# EAGLE design Placa_painel_Revisao (EAGLE 9.4.2)

## Sheet 1 of 2
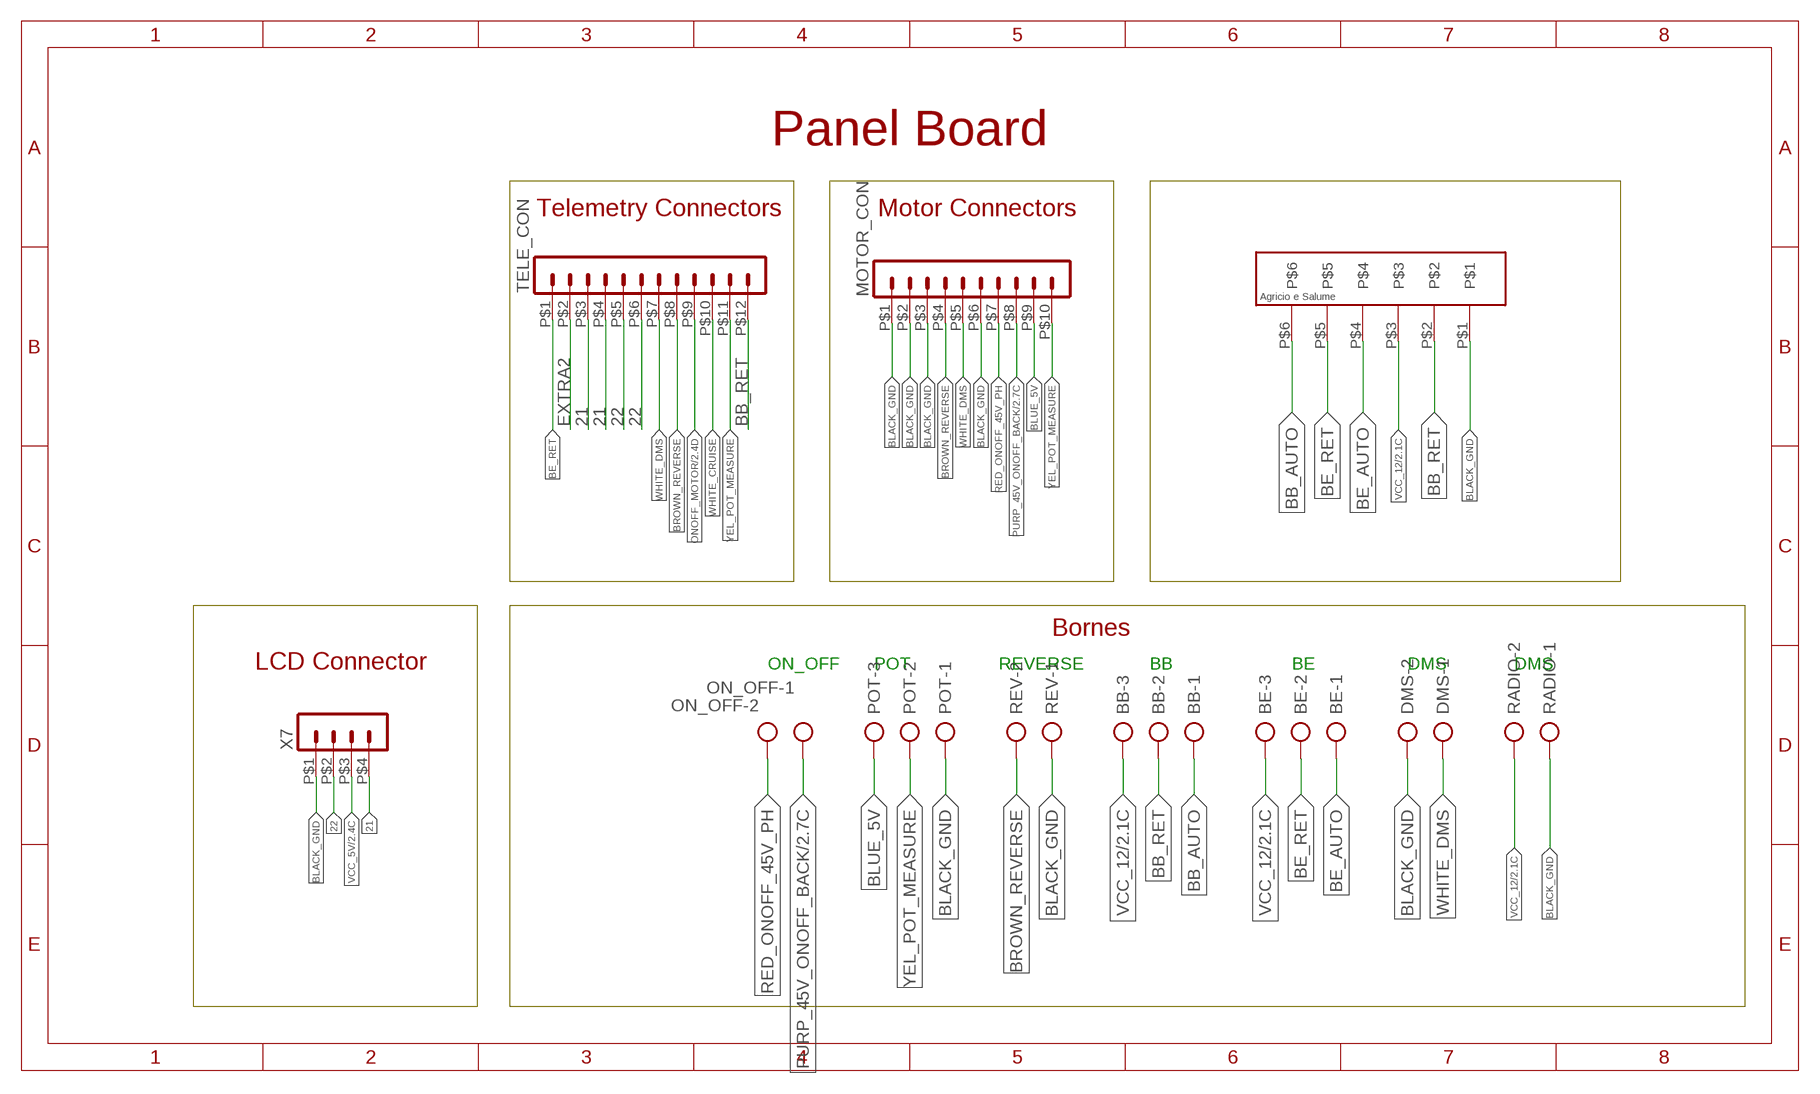
[diagram p0: schematic, sheet 1]

### Parts
BB  AK500/3  [AK500/3]
BE  AK500/3  [AK500/3]
DMS  AK500/2  [AK500/2]
MOTOR_CON  HEADER_POS10_43045-1012  [43045-1012]
ON_OFF  AK500/2  [AK500/2]
POT  AK500/3  [AK500/3]
RADIO  AK500/2  [AK500/2]
REV  AK500/2  [AK500/2]
TELE_CON  HEADER_POS12_43045-1212  [43045-1212]
U$1  CON_HOLE  [CON_HOLE_6]
X7  HEADER_POS4_43045-0412  [43045-0412]

### Nets
21: TELE_CON.P$3 TELE_CON.P$4 X7.P$4
22: TELE_CON.P$5 TELE_CON.P$6 X7.P$2
BB_AUTO: BB.1 U$1.P$6
BB_RET: BB.2 TELE_CON.P$12 U$1.P$2
BE_AUTO: BE.1 U$1.P$4
BE_RET: BE.2 TELE_CON.P$1 U$1.P$5
BLACK_GND: DMS.2 MOTOR_CON.P$1 MOTOR_CON.P$2 MOTOR_CON.P$3 MOTOR_CON.P$6 POT.1 RADIO.1 REV.1 U$1.P$1 X7.P$1 ; also sheet 2
BLUE_5V: MOTOR_CON.P$9 POT.3
BROWN_REVERSE: MOTOR_CON.P$4 REV.2 TELE_CON.P$8
EXTRA2: TELE_CON.P$2
ONOFF_MOTOR: TELE_CON.P$9 ; also sheet 2
PURP_45V_ONOFF_BACK: MOTOR_CON.P$8 ON_OFF.1 ; also sheet 2
RED_ONOFF_45V_PH: MOTOR_CON.P$7 ON_OFF.2
VCC_5V: X7.P$3 ; also sheet 2
VCC_12: BB.3 BE.3 RADIO.2 U$1.P$3 ; also sheet 2
WHITE_CRUISE: TELE_CON.P$10
WHITE_DMS: DMS.1 MOTOR_CON.P$5 TELE_CON.P$7
YEL_POT_MEASURE: MOTOR_CON.P$10 POT.2 TELE_CON.P$11

### Notes on the sheet
- Panel Board
- Telemetry Connectors | Motor Connectors
- Bornes
- LCD Connector
- ON_OFF | POT | REVERSE | BB | BE | DMS | DMS

## Sheet 2 of 2
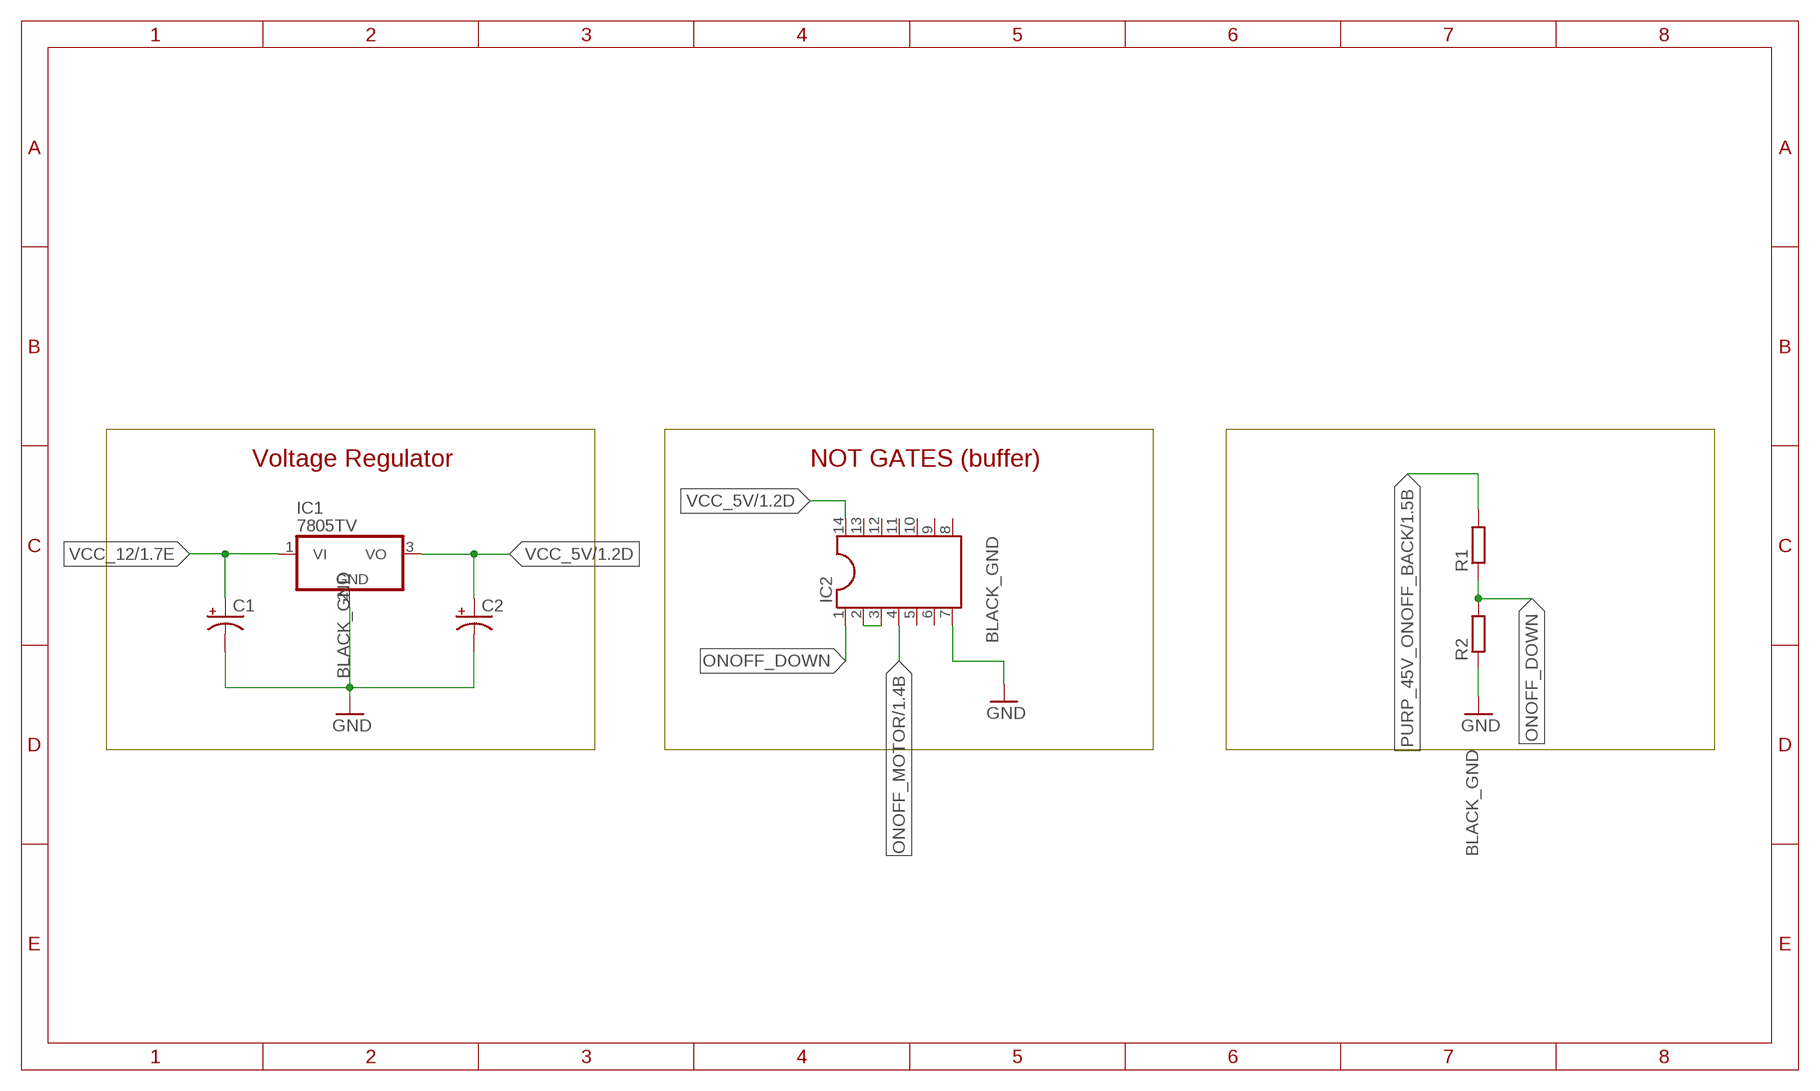
[diagram p1: schematic, sheet 2]

### Parts
C1  CPOL-USE5-5  [E5-5]
C2  CPOL-USE5-5  [E5-5]
IC1  7805TV  [TO220V]
IC2  DIL14  [DIL14]
R1  R-EU_0204/7  [0204/7]
R2  R-EU_0204/7  [0204/7]

### Nets
BLACK_GND: C1.- C2.- IC1.2(GND) IC2.7 R2.1 ; supply symbol labelled GND ; also sheet 1
N$4: IC2.2 IC2.3
ONOFF_DOWN: IC2.1 R1.1 R2.2
ONOFF_MOTOR: IC2.4 ; also sheet 1
PURP_45V_ONOFF_BACK: R1.2 ; also sheet 1
VCC_5V: C2.+ IC1.3(VO) IC2.14 ; also sheet 1
VCC_12: C1.+ IC1.1(VI) ; also sheet 1
Unconnected: IC2.5 IC2.6 IC2.8 IC2.9 IC2.10 IC2.11 IC2.12 IC2.13

### Notes on the sheet
- Voltage Regulator | NOT GATES (buffer)

## Library data of the parts
BB BE POT = con-ptr500:AK500/3: CONNECTOR; OC_FARNELL: unknown; OC_NEWARK: unknown
C1 C2 = rcl:CPOL-US: POLARIZED CAPACITOR, American symbol; SPICEPREFIX: C
DMS ON_OFF RADIO REV = con-ptr500:AK500/2: CONNECTOR; OC_FARNELL: unknown; OC_NEWARK: unknown
IC1 = linear:78*: Positive VOLTAGE REGULATOR Source: http://cache.national.com/ds/LM/LM78L05.pdf http://www.fairchildsemi.com/ds/LM/LM7805.pdf
IC2 = ic-package:DIL14: Dual In Line / Socket
MOTOR_CON = con-molex-micro-fit-3_0:HEADER_POS10_?: Molex - Micro-Fit 3.0 Series connector, 3.00mm (0.118") pitch header, 10 positions.
R1 R2 = rcl:R-EU_: RESISTOR, European symbol; SPICEPREFIX: R
TELE_CON = con-molex-micro-fit-3_0:HEADER_POS12_?: Molex - Micro-Fit 3.0 Series connector, 3.00mm (0.118") pitch header, 12 positions.
U$1 = bibliotecattgo:CON_HOLE
X7 = con-molex-micro-fit-3_0:HEADER_POS4_?: Molex - Micro-Fit 3.0 Series connector, 3.00mm (0.118") pitch header, 4 positions.

## Board
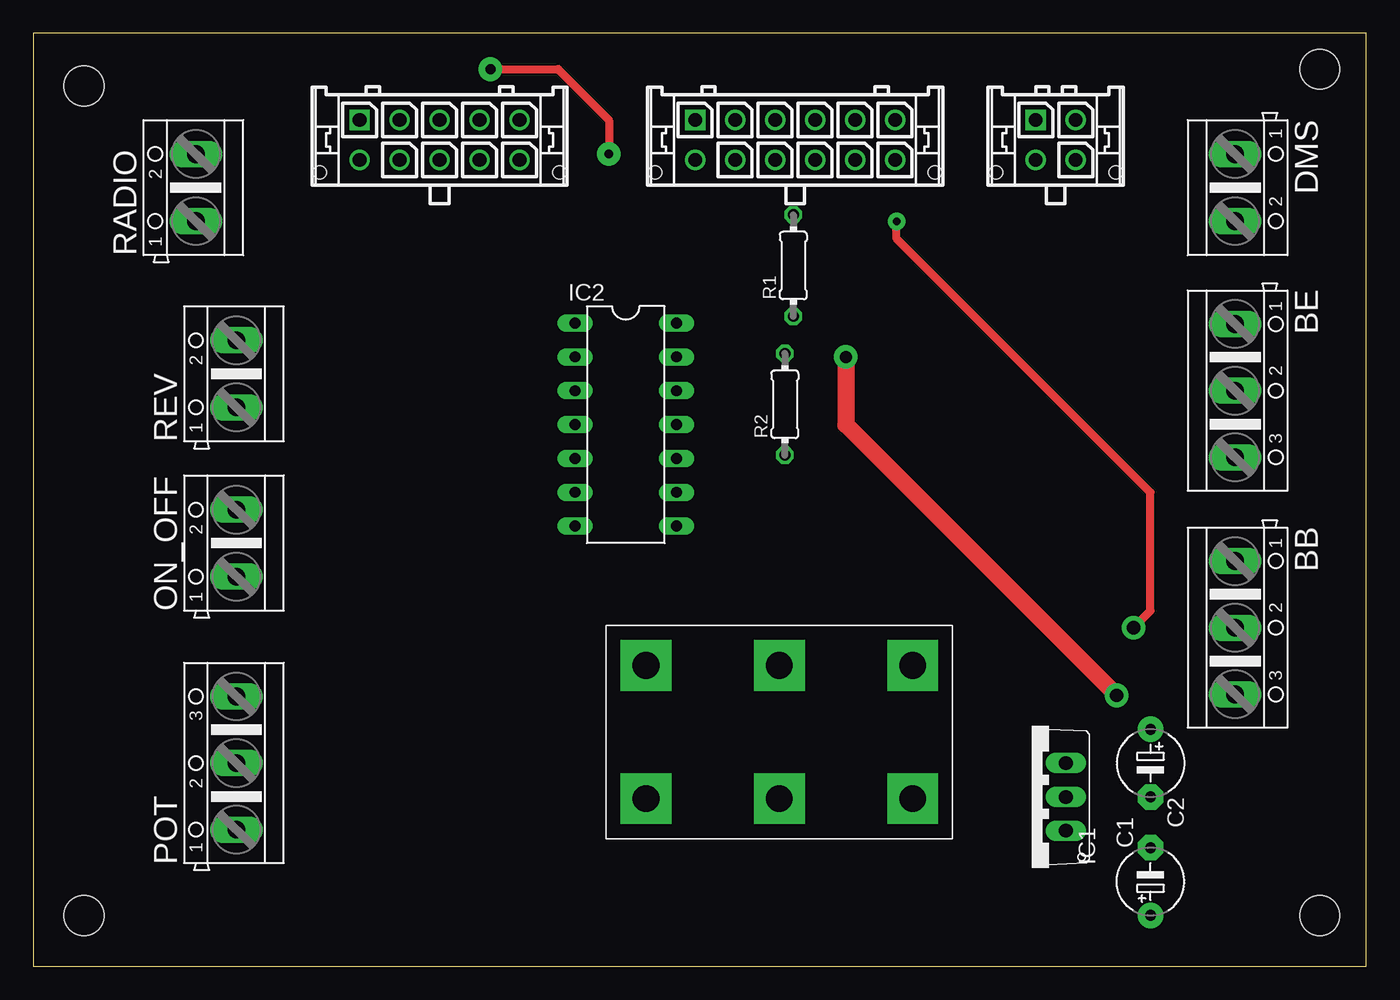
[diagram p2: board, top side]
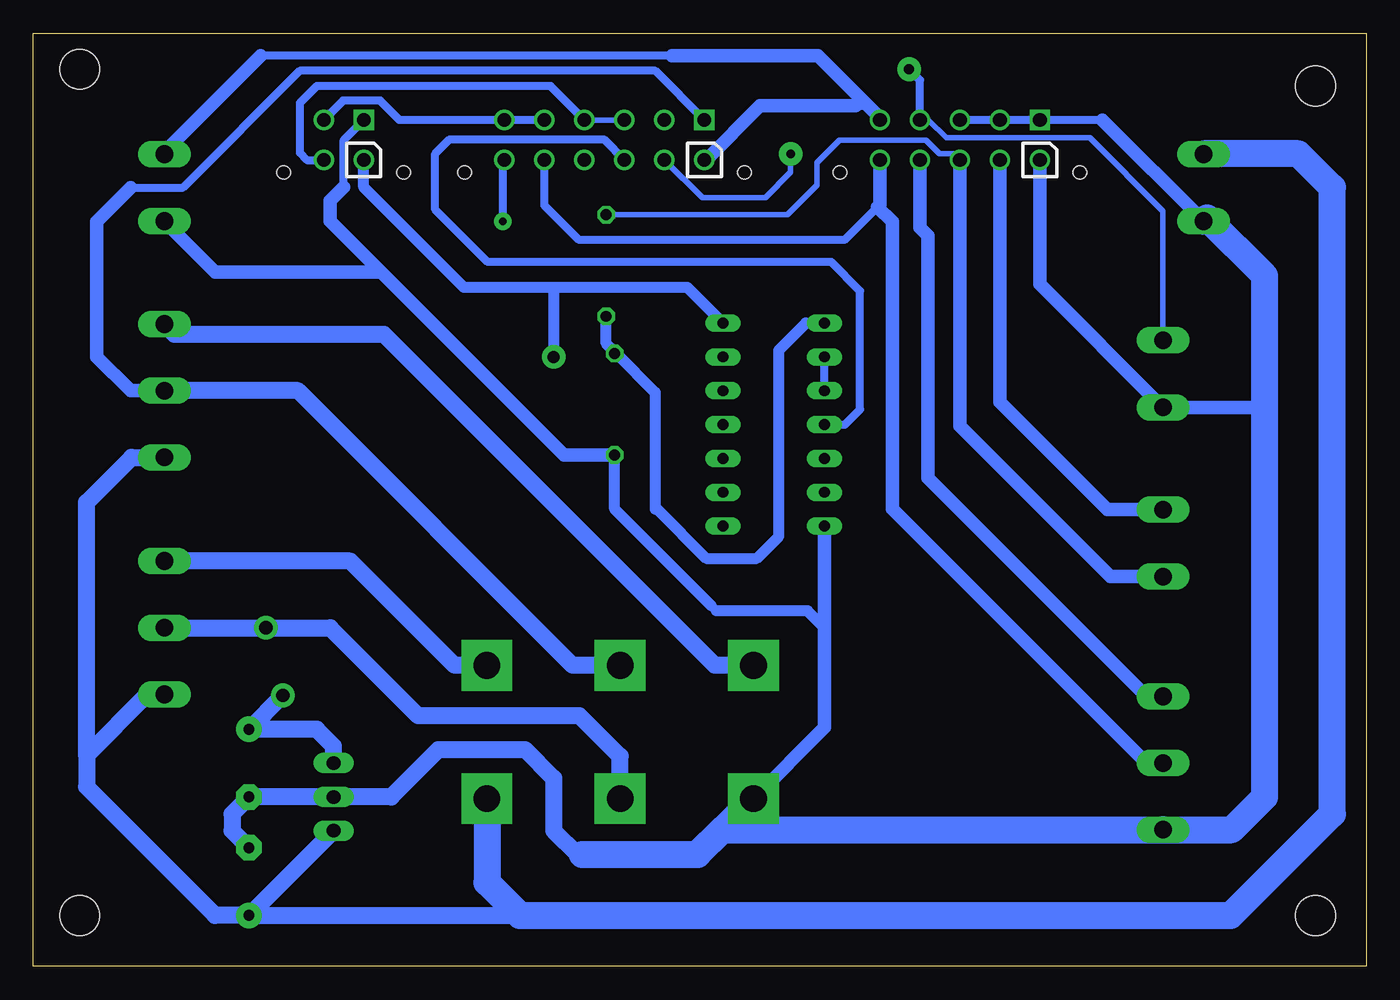
[diagram p3: board, bottom side, seen from below]

Size 100 x 70 mm. Coordinates in mm from the lower left corner, seen from the top.
Outline: 0,0 100,0 100,70 0,70 0,0
Copper layers (1*16): Top 0.035mm / dielectric 1.5mm / Bottom 0.035mm
Design rules "default *": minimum track width 6mil, minimum drill 0.35mm, track to track 8mil, track to pad 15mil, pad to pad 40mil, via to via 50mil, smd to smd 6mil, copper to edge 40mil, drill to drill 6mil, minimum pad ring 10mil, minimum via ring 8mil, stop-mask expansion 4mil, vias tented up to drill 0mil, thermal gap 5mil
Holes 3 mm at 3.81,66.04 3.81,3.81 96.52,67.31 96.52,3.81

### Footprints (pad centres in the part's own frame; a part is rotated, then mirrored left to right if it is on the bottom)
AK500/3 = drill 1.321 long: 1 -5.004,0; 2 0,0; 3 5.004,0
E5-5 = drill 0.813 pad 1.905: + -2.54,0 | drill 0.813 pad 1.905 octagon: - 2.54,0
AK500/2 = drill 1.321 long: 1 -2.515,0; 2 2.515,0
TO220V = drill 1.016 long: 1 -2.54,-2.54; 2 0,-2.54; 3 2.54,-2.54
DIL14 = drill 0.813 long: 1 -7.62,-3.81; 2 -5.08,-3.81; 3 -2.54,-3.81; 4 0,-3.81; 5 2.54,-3.81; 6 5.08,-3.81; 7 7.62,-3.81; 8 7.62,3.81; 9 5.08,3.81; 10 2.54,3.81; 11 0,3.81; 12 -2.54,3.81; 13 -5.08,3.81; 14 -7.62,3.81
43045-1012 = drill 1.02 square: P$1 6,0 | drill 1.02: P$2 3,0; P$3 0,0; P$4 -3,0; P$5 -6,0; P$6 6,3; P$7 3,3; P$8 0,3; P$9 -3,3; P$10 -6,3 | hole 1.02: 9,3.94; -9,3.94
0204/7 = drill 0.813 octagon: 1 -3.81,0; 2 3.81,0
43045-1212 = drill 1.02 square: P$1 7.5,0 | drill 1.02: P$2 4.5,0; P$3 1.5,0; P$4 -1.5,0; P$5 -4.5,0; P$6 -7.5,0; P$7 7.5,3; P$8 4.5,3; P$9 1.5,3; P$10 -1.5,3; P$11 -4.5,3; P$12 -7.5,3 | hole 1.02: 10.5,3.94; -10.5,3.94
CON_HOLE_6 = drill 2 pad 3.81 square: P$1 0,0; P$2 10,0; P$3 20,0; P$4 0,10; P$5 10,10; P$6 20,10
43045-0412 = drill 1.02 square: P$1 1.5,0 | drill 1.02: P$2 -1.5,0; P$3 1.5,3; P$4 -1.5,3 | hole 1.02: 4.5,3.94; -4.5,3.94

### Placement (x,y rotation side)
BB  90.17,25.4 270 top
BE  90.17,43.18 270 top
C1  83.82,6.35 90 top
C2  83.82,15.24 270 top
DMS  90.17,58.42 270 top
IC1  74.93,12.7 90 top
IC2  44.45,40.64 270 top
MOTOR_CON  30.48,63.5 180 top
ON_OFF  15.24,31.75 90 top
POT  15.24,15.24 90 top
R1  57.02,52.58 90 top
R2  56.39,42.16 90 top
RADIO  12.19,58.42 90 top
REV  15.24,44.45 90 top
TELE_CON  57.15,63.5 180 top
U$1  45.97,12.57 0 top
X7  76.71,63.5 180 top

### Tracks (layer width: path | path; a pad name or v marks a point on that pad's centre or on a via)
21
  Bottom 0.406: TELE_CON.P$3 TELE_CON.P$4
  Bottom 0.61: TELE_CON.P$4 61.19,66.04 78.74,66.04 80.01,64.77 80.01,61.03 79.48,60.5 X7.P$4
22
  Bottom 0.61: X7.P$2 76.76,64.95 73.97,64.95 72.52,63.5 TELE_CON.P$6 TELE_CON.P$5
BB_AUTO
  Bottom 1.27: U$1.P$6 68.39,22.57 76.22,30.4 BB.1
BB_RET  (via drill 0.55 pad 1.3, 1 pad 1.78)
  Top 0.61: v82.55,25.4 83.82,26.67 83.82,35.56 64.77,54.61 v64.77,55.88
  Bottom 0.61: v64.77,55.88 64.77,60.38 TELE_CON.P$12
  Bottom 1.27: U$1.P$2 55.97,15.75 59.02,18.8 71.12,18.8 77.72,25.4 v82.55,25.4 BB.2
BE_AUTO
  Bottom 1.27: U$1.P$4 48.86,22.57 73.71,47.42 89.41,47.42 BE.1
BE_RET
  Bottom 0.61: TELE_CON.P$1 53.33,67.18 80.01,67.18 88.77,58.42 92.71,58.42
  Bottom 1.016: BE.2 92.71,43.18 95.25,45.72 95.25,55.88 92.71,58.42
  Bottom 1.27: BE.2 80.14,43.18 59.53,22.57 U$1.P$5
BLACK_GND
  Bottom 0.61: X7.P$1 76.71,62 76.71,58.45 | 19.79,63.5 MOTOR_CON.P$1 MOTOR_CON.P$2 MOTOR_CON.P$3 | 48.77,26.67 49.15,27.05
  Bottom 0.813: 40.64,25.4 41.91,26.67 48.77,26.67 | R2.1 56.39,34.29 49.15,27.05
  Bottom 1.016: 7.62,41.91 7.64,41.94 REV.1 24.48,51.17 MOTOR_CON.P$6 | U$1.P$1 40.64,17.91 40.64,25.4 IC2.7 | R2.1 60.17,38.35 73.91,52.09 | 73.91,52.09 77.72,55.91 77.72,57.43 76.71,58.45 | 73.91,52.09 86.36,52.09 DMS.2 | RADIO.1 19.79,63.5
  Bottom 1.27: C1.- 85.09,10.16 85.09,11.43 C2.- IC1.2 73.15,12.7 69.6,16.26 63.12,16.26 60.96,14.1 60.96,10.16 59.18,8.38 58.8,8.38
  Bottom 2.032: 58.8,8.38 50.16,8.38 48.31,10.24 | RADIO.1 11.95,56.15 7.62,51.82 7.62,41.91 7.62,12.7 10.08,10.24 POT.1 48.31,10.24 | 48.31,10.24 U$1.P$1
BLUE_5V
  Bottom 1.016: POT.3 16.51,20.24 32.89,36.63 32.89,54.83 33.48,55.42 MOTOR_CON.P$9
BROWN_REVERSE  (via drill 0.65 pad 1.78, 0.75 pad 1.78)
  Top 0.61: v34.29,67.31 39.37,67.31 43.18,63.5 v43.18,60.96
  Bottom 0.406: REV.2 15.24,56.65 20.74,62.15 31.5,62.15 32.84,63.5 MOTOR_CON.P$4 | TELE_CON.P$8 49.81,57.66 45.09,57.66 43.18,59.56 v43.18,60.96
  Bottom 0.61: MOTOR_CON.P$4 33.48,66.5 v34.29,67.31
N$4
  Bottom 0.61: IC2.3 IC2.2
ONOFF_DOWN
  Bottom 0.61: IC2.1 42.04,48.26 | 49.53,30.61 49.66,30.61 53.34,34.29 | R2.2 56.26,45.97
  Bottom 0.813: 56.26,45.97 53.34,43.05 53.34,34.29 53.21,34.29 49.53,30.61 45.72,30.61 44.07,32.26 44.07,46.23 42.04,48.26 | R2.2 56.39,46.1 57.02,46.74 R1.1
ONOFF_MOTOR
  Bottom 0.61: IC2.4 39.12,40.64 37.97,41.78 37.97,50.67 40.13,52.83 65.91,52.83 69.85,56.77 69.85,60.96 68.76,62.05 57.2,62.05 TELE_CON.P$9
PURP_45V_ONOFF_BACK
  Bottom 0.406: MOTOR_CON.P$8 30.94,60.96 32.03,60.96 33.05,61.98 39.51,61.98 41.21,60.28 41.21,58.61 43.43,56.39 R1.2
  Bottom 1.016: ON_OFF.1 19.18,29.23 30.48,40.54 MOTOR_CON.P$8
RED_ONOFF_45V_PH
  Bottom 1.016: MOTOR_CON.P$7 27.48,42.31 19.43,34.27 ON_OFF.2
VCC_5V  (via drill 0.9 pad 1.78, 1 pad 1.78)
  Top 1.27: v81.28,20.32 60.96,40.64 v60.96,45.72
  Bottom 0.813: IC2.14 50.93,50.93 60.96,50.93 | 60.96,50.93 v60.96,45.72 | 60.96,50.93 67.69,50.93 75.21,58.45 X7.P$3
  Bottom 1.27: IC1.3 77.47,16.51 78.74,17.78 C2.+ v81.28,20.32
VCC_12
  Bottom 1.27: 96.01,15.82 91.44,20.4 BB.3 | 96.01,15.82 96.01,13.46 86.36,3.81 C1.+ | 96.01,15.82 96.01,34.8 92.63,38.18 BE.3 | C1.+ 53.34,3.81 | C1.+ IC1.1
  Bottom 2.032: U$1.P$3 65.97,6.28 63.5,3.81 53.34,3.81 10.16,3.81 2.54,11.43 2.54,58.42 5.08,60.96 12.17,60.96 RADIO.2
WHITE_DMS
  Bottom 0.61: 49.53,60.5 TELE_CON.P$7 | 44.57,64.56 37.54,64.56 | 37.54,64.56 37.39,64.56 37.85,65.02 41.15,68.33 | 52.07,68.33 82.93,68.33 | 37.54,64.56 MOTOR_CON.P$5
  Bottom 1.016: MOTOR_CON.P$5 36.48,63.66 37.39,64.56 41.15,68.33 52.07,68.33 | 37.85,65.02 38.31,64.56 44.57,64.56 45.47,64.56 49.53,60.5 | DMS.1 90.17,61.09 82.93,68.33
YEL_POT_MEASURE
  Bottom 0.61: 36.48,57.15 36.48,56.8 35.56,55.88 | 36.66,56.98 39.15,54.48 59.05,54.48 61.65,57.08 TELE_CON.P$11
  Bottom 1.016: POT.2 16.51,15.24 35.56,34.29 35.56,55.88 36.66,56.98 36.48,57.15 MOTOR_CON.P$10